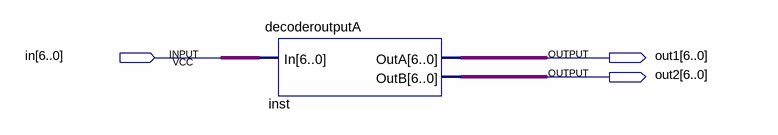
[diagram p0: schematic sheet]
// Quartus schematic test_decfromula.bdf as structural Verilog: 1 symbols, 3 pins
module test_decfromula (
  input  [6:0] in,
  output [6:0] out1,
  output [6:0] out2
);

  decoderoutputA inst (.In(in), .OutA(out1), .OutB(out2));
endmodule
